# EAGLE design BpodFSM_r2_0 (EAGLE 7.7.0)
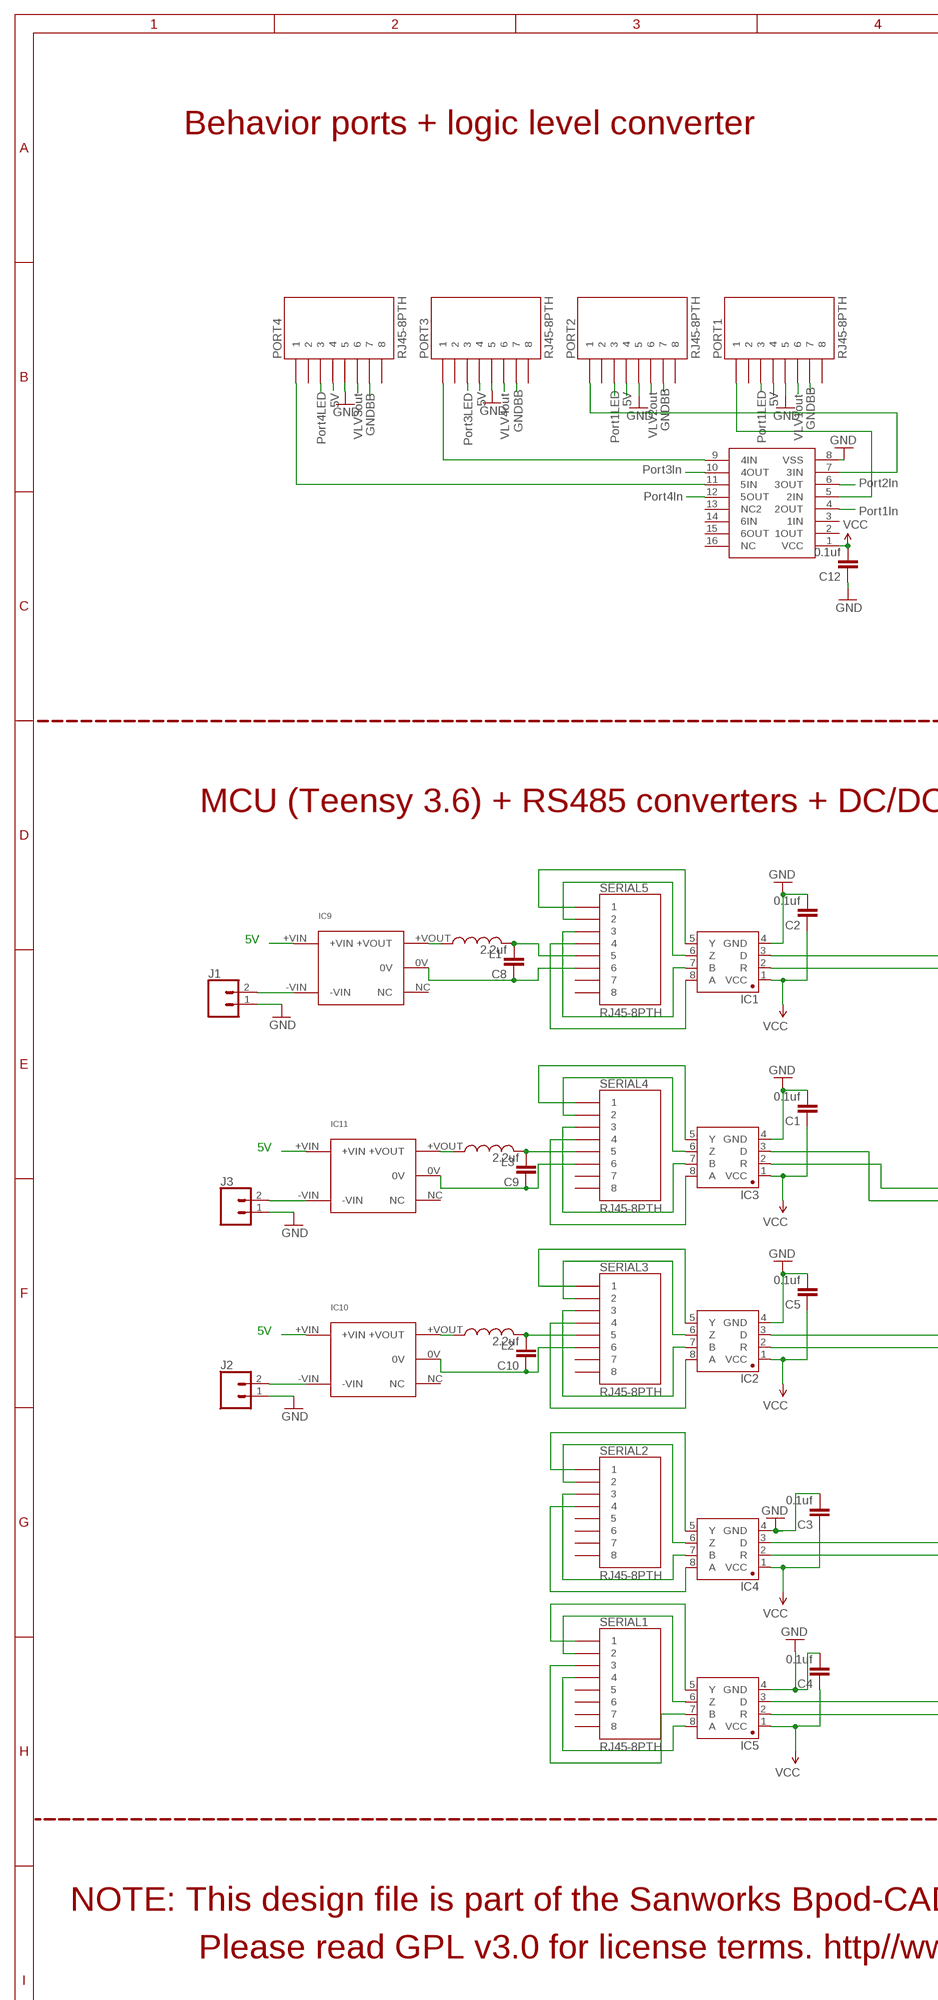
[diagram p0: schematic, sheet 1, part 1 of 2]
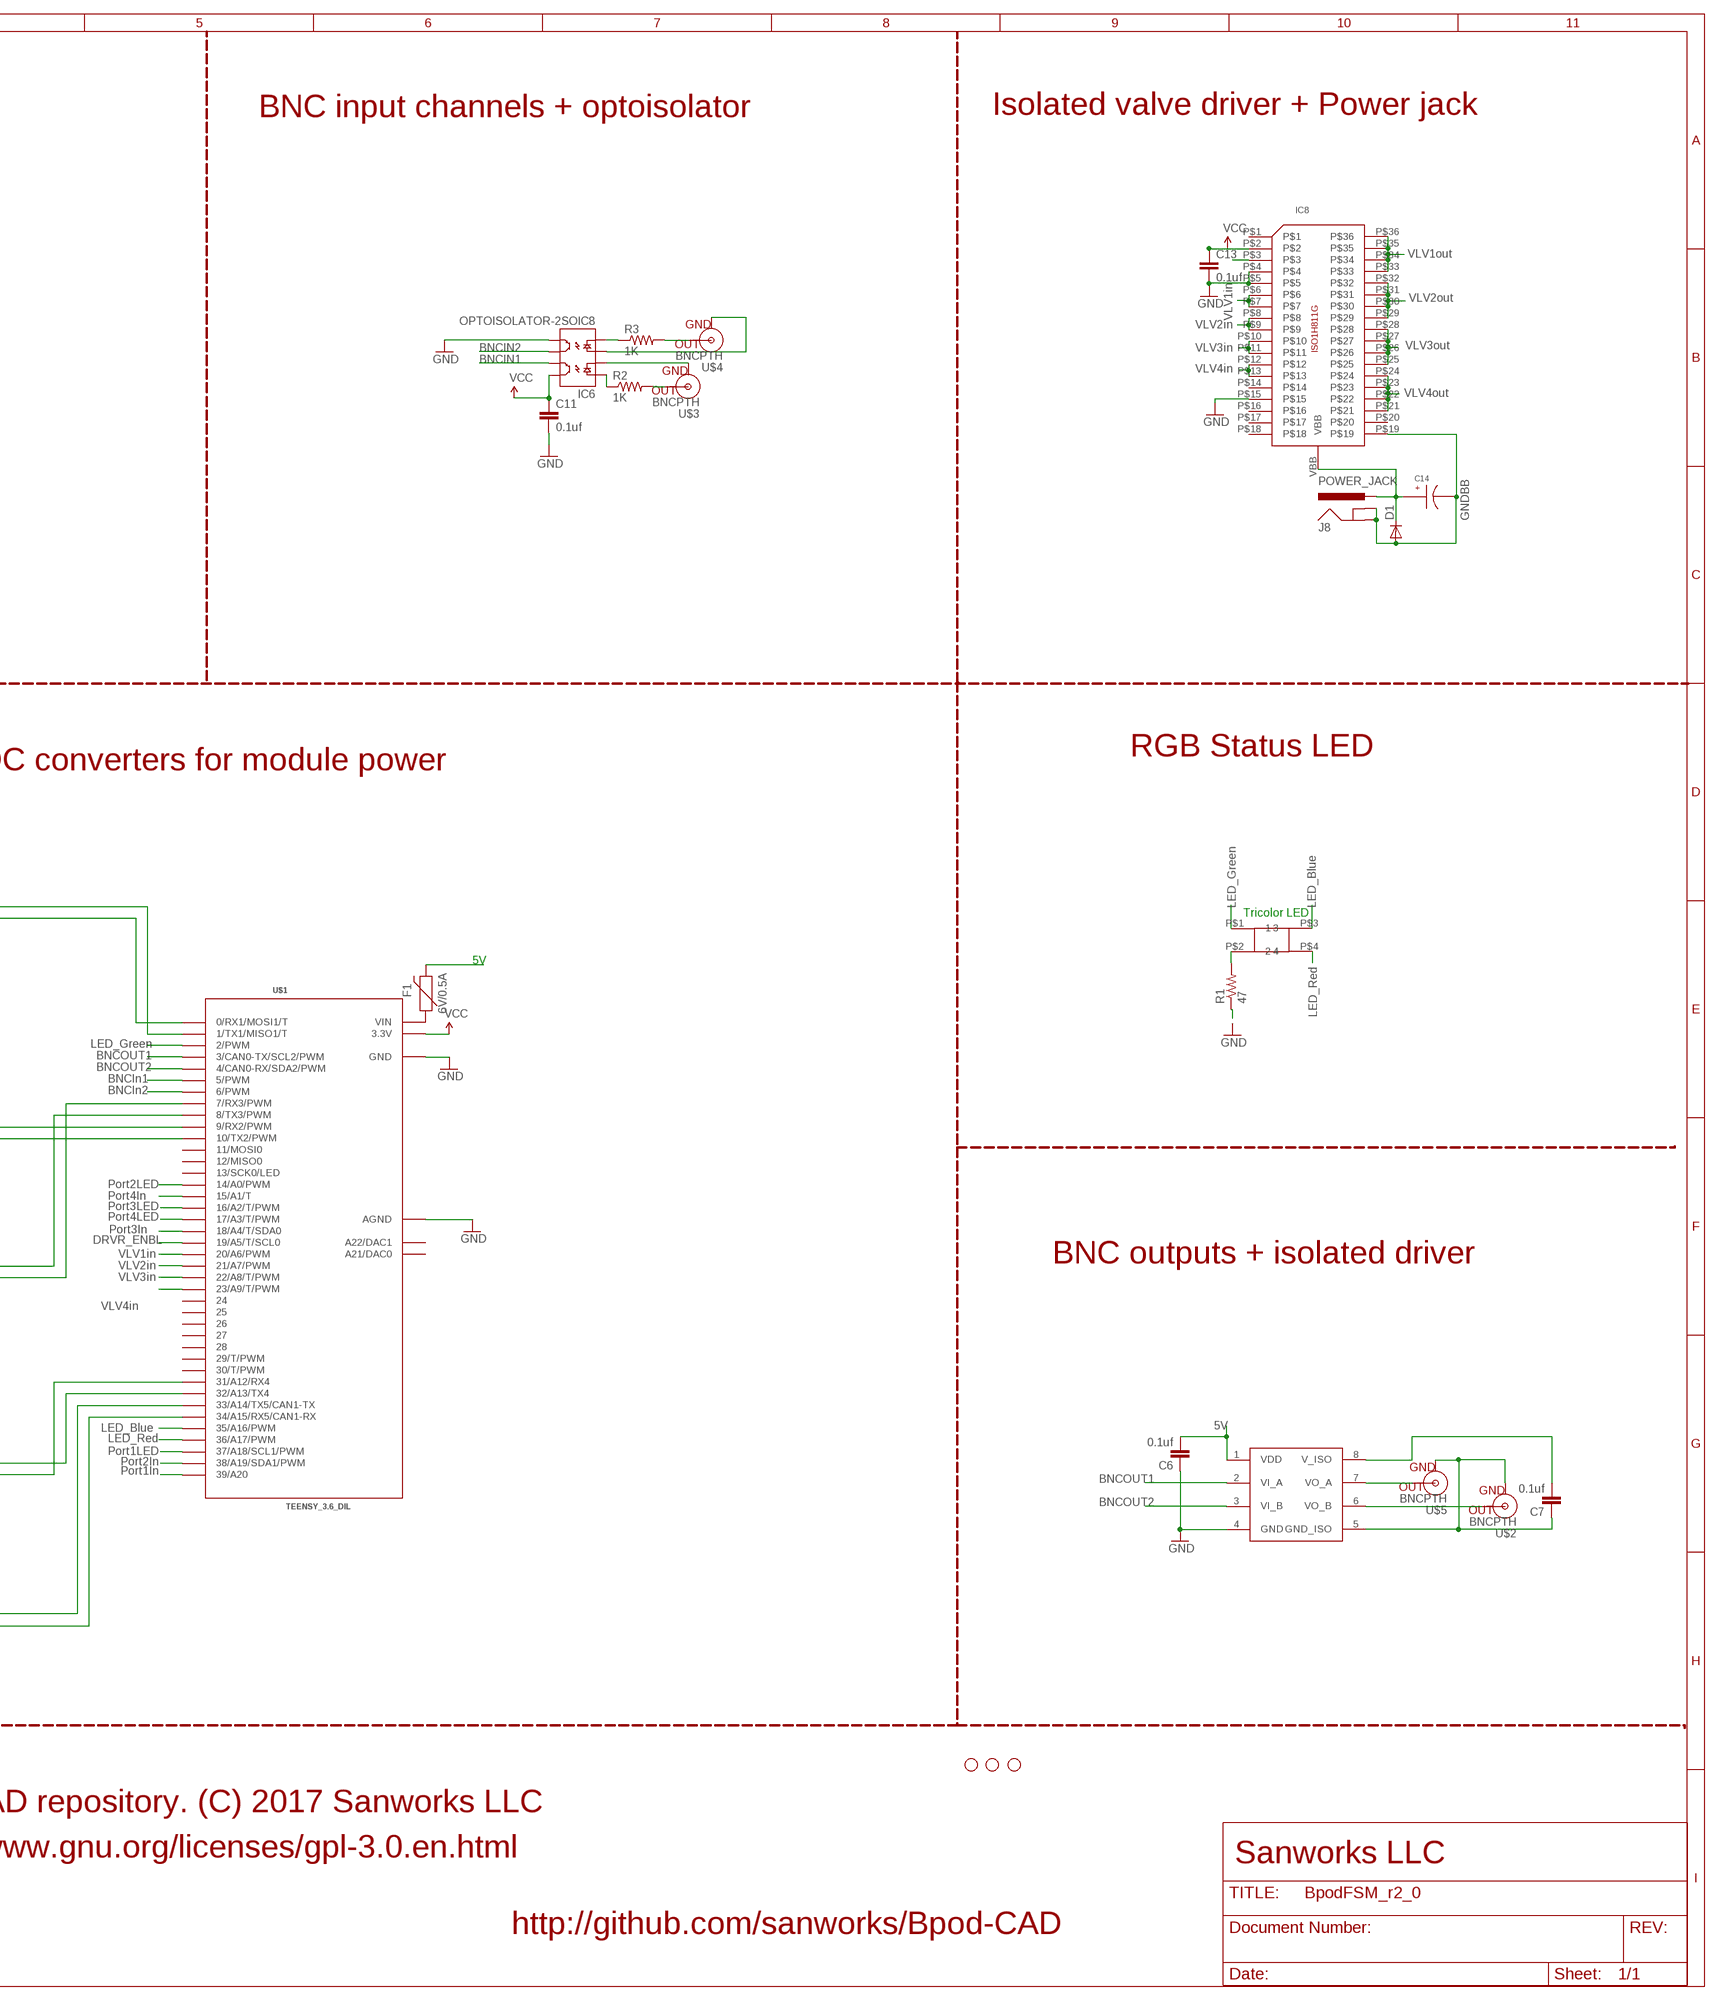
[diagram p1: schematic, sheet 1, part 2 of 2]

## Parts
C1  0.1uf  CAP1206  [1206]
C2  0.1uf  CAP1206  [1206]
C3  0.1uf  CAP1206  [1206]
C4  0.1uf  CAP1206  [1206]
C5  0.1uf  CAP1206  [1206]
C6  0.1uf  CAP1206  [1206]
C7  0.1uf  CAP1206  [1206]
C8  2.2uf  CAP1206  [1206]
C9  2.2uf  CAP1206  [1206]
C10  2.2uf  CAP1206  [1206]
C11  0.1uf  CAP1206  [1206]
C12  0.1uf  CAP1206  [1206]
C13  0.1uf  CAP1206  [1206]
C14  EEE-FK1H100UR  [EEE-FK1H100UR]
D1  DIODE-DO214AA  [DO214AA]
F1  6V/0.5A  PPTC_HALF-AMP  [1206]
IC1  SN65HVD31DR  [SO08]
IC2  SN65HVD31DR  [SO08]
IC3  SN65HVD31DR  [SO08]
IC4  SN65HVD31DR  [SO08]
IC5  SN65HVD31DR  [SO08]
IC6  OPTOISOLATOR-2SOIC8  [SO08-2]
IC7  ADUM5240  [SO08]
IC8  ISO1H811G  [ISO1H811G]
IC9  MTU1D0505MC  [MTU1D0505MC]
IC10  MTU1D0505MC  [MTU1D0505MC]
IC11  MTU1D0505MC  [MTU1D0505MC]
IC12  CD4050  [SO16]
J1  CONN_02  [1X02]
J2  CONN_02  [1X02]
J3  CONN_02  [1X02]
J8  POWER_JACK  [POWER_JACK_PTH]
JP3  STAND-OFF  [STAND-OFF]
JP4  STAND-OFF  [STAND-OFF]
JP5  STAND-OFF  [STAND-OFF]
L1  L-USL3225M  [L3225M]
L2  L-USL3225M  [L3225M]
L3  L-USL3225M  [L3225M]
PORT1  RJ45-8PTH  [RJ45-8]
PORT2  RJ45-8PTH  [RJ45-8]
PORT3  RJ45-8PTH  [RJ45-8]
PORT4  RJ45-8PTH  [RJ45-8]
R1  47  RESISTOR1206  [1206]
R2  1K  RESISTOR1206  [1206]
R3  1K  RESISTOR1206  [1206]
SERIAL1  RJ45-8PTH  [RJ45-8]
SERIAL2  RJ45-8PTH  [RJ45-8]
SERIAL3  RJ45-8PTH  [RJ45-8]
SERIAL4  RJ45-8PTH  [RJ45-8]
SERIAL5  RJ45-8PTH  [RJ45-8]
U$1  TEENSY_3.6_DIL  [TEENSY_3.6_DIL]
U$2  BNCPTH  [BNC]
U$3  BNCPTH  [BNC]
U$4  BNCPTH  [BNC]
U$5  BNCPTH  [BNC]
U$8  SQUARE_TRICOLOR_LED  [SQUARE_TRICOLOR_LED]

## Nets
5V: C6.2 F1.2 IC7.1(VDD) IC9.+VIN IC10.+VIN IC11.+VIN PORT1.4 PORT2.4 PORT3.4 PORT4.4
BNCIN1: IC6.7(EM1) U$1.6(6/PWM)
BNCIN2: IC6.6(CL2) U$1.5(5/PWM)
BNCOUT1: IC7.3(VI_B) U$1.4(4/CAN0-RX/SDA2/PWM)
BNCOUT2: IC7.2(VI_A) U$1.3(3/CAN0-TX/SCL2/PWM)
DRVR_ENBL: IC8.P$3 U$1.19/A5(19/A5/T/SCL0)
GND: C1.2 C2.2 C3.2 C4.2 C5.2 C6.1 C11.2 C12.1 C13.2 IC1.4(GND) IC2.4(GND) IC3.4(GND) IC4.4(GND) IC5.4(GND) IC6.5(EM2) IC7.4(GND) IC8.P$4 IC8.P$5 IC8.P$15 IC12.8(VSS) J1.1 J2.1 J3.1 PORT1.5 PORT2.5 PORT3.5 PORT4.5 R1.1 U$1.AGND U$1.GND U$1.GND1(GND)
GNDBB: C14.CATHODE D1.A IC8.P$19 J8.GND J8.GNDBREAK PORT1.7 PORT2.7 PORT3.7 PORT4.7
ISOGND: C7.1 IC7.5(GND_ISO) U$2.GND U$5.GND
LED_BLUE: U$1.35/A16(35/A16/PWM) U$8.P$3
LED_GREEN: U$1.2(2/PWM) U$8.P$1
LED_RED: U$1.36/A17(36/A17/PWM) U$8.P$4
N$1: IC3.8(A) SERIAL4.4
N$2: IC3.7(B) SERIAL4.3
N$3: IC3.6(Z) SERIAL4.2
N$4: IC3.5(Y) SERIAL4.1
N$5: IC3.2(R) U$1.9(9/RX2/PWM)
N$6: IC3.3(D) U$1.10(10/TX2/PWM)
N$7: IC1.8(A) SERIAL5.4
N$8: IC1.7(B) SERIAL5.3
N$9: IC1.6(Z) SERIAL5.2
N$10: IC1.5(Y) SERIAL5.1
N$11: IC1.2(R) U$1.0(0/RX1/MOSI1/T)
N$12: IC1.3(D) U$1.1(1/TX1/MISO1/T)
N$13: IC6.3(A2) U$4.GND
N$14: R3.2 U$4.S(OUT)
N$15: R2.2 U$3.S(OUT)
N$16: IC6.2(C1) U$3.GND
N$17: IC2.8(A) SERIAL3.4
N$18: IC2.7(B) SERIAL3.3
N$19: IC2.6(Z) SERIAL3.2
N$20: IC12.7(3IN) PORT2.1
N$21: IC2.5(Y) SERIAL3.1
N$22: IC2.2(R) U$1.7(7/RX3/PWM)
N$23: C8.2 L1.2 SERIAL5.5
N$24: IC12.9(4IN) PORT3.1
N$25: R1.2 U$8.P$2
N$26: C8.1 IC9.0V SERIAL5.6
N$27: IC7.7(VO_A) U$5.S(OUT)
N$28: IC2.3(D) U$1.8(8/TX3/PWM)
N$29: F1.1 U$1.VIN
N$30: IC7.6(VO_B) U$2.S(OUT)
N$31: IC12.11(5IN) PORT4.1
N$32: IC5.8(A) SERIAL1.4
N$33: IC5.7(B) SERIAL1.3
N$34: IC5.6(Z) SERIAL1.2
N$35: IC5.5(Y) SERIAL1.1
N$36: IC4.8(A) SERIAL2.4
N$37: IC4.7(B) SERIAL2.3
N$38: IC4.6(Z) SERIAL2.2
N$39: IC9.+VOUT L1.1
N$40: IC4.5(Y) SERIAL2.1
N$41: IC9.-VIN J1.2
N$42: IC5.2(R) U$1.34/A15(34/A15/RX5/CAN1-RX)
N$43: C10.1 IC10.0V SERIAL3.6
N$44: C10.2 L2.2 SERIAL3.5
N$45: IC10.+VOUT L2.1
N$46: IC10.-VIN J2.2
N$47: C9.1 IC11.0V SERIAL4.6
N$48: IC5.3(D) U$1.33/A14(33/A14/TX5/CAN1-TX)
N$49: C9.2 L3.2 SERIAL4.5
N$50: IC11.+VOUT L3.1
N$51: IC11.-VIN J3.2
N$52: IC4.2(R) U$1.31/A12(31/A12/RX4)
N$53: IC4.3(D) U$1.32/A13(32/A13/TX4)
N$54: IC6.1(A1) R2.1
N$55: IC6.4(C2) R3.1
N$56: IC12.5(2IN) PORT1.1
N$64: C7.2 IC7.8(V_ISO)
PORT1IN: IC12.4(2OUT) U$1.39/A20
PORT1LED: PORT1.3 U$1.37/A18(37/A18/SCL1/PWM)
PORT2IN: IC12.6(3OUT) U$1.38/A19(38/A19/SDA1/PWM)
PORT2LED: PORT2.3 U$1.14/A0(14/A0/PWM)
PORT3IN: IC12.10(4OUT) U$1.18/A4(18/A4/T/SDA0)
PORT3LED: PORT3.3 U$1.16/A2(16/A2/T/PWM)
PORT4IN: IC12.12(5OUT) U$1.15/A1(15/A1/T)
PORT4LED: PORT4.3 U$1.17/A3(17/A3/T/PWM)
VBB: C14.ANODE D1.C IC8.VBB J8.PWR
VCC: C1.1 C2.1 C3.1 C4.1 C5.1 C11.1 C12.2 C13.1 IC1.1(VCC) IC2.1(VCC) IC3.1(VCC) IC4.1(VCC) IC5.1(VCC) IC6.8(CL1) IC8.P$2 IC12.1(VCC) U$1.3.3V U$1.3.3V3(3.3V)
VLV1IN: IC8.P$6 IC8.P$7 U$1.23/A9(23/A9/T/PWM)
VLV1OUT: IC8.P$33 IC8.P$34 IC8.P$35 IC8.P$36 PORT1.6
VLV2IN: IC8.P$8 IC8.P$9 U$1.22/A8(22/A8/T/PWM)
VLV2OUT: IC8.P$29 IC8.P$30 IC8.P$31 IC8.P$32 PORT2.6
VLV3IN: IC8.P$12 IC8.P$13 U$1.20/A6(20/A6/PWM)
VLV3OUT: IC8.P$21 IC8.P$22 IC8.P$23 IC8.P$24 PORT3.6
VLV4IN: IC8.P$10 IC8.P$11 U$1.21/A7(21/A7/PWM)
VLV4OUT: IC8.P$25 IC8.P$26 IC8.P$27 IC8.P$28 PORT4.6
Unconnected: IC8.P$1 IC8.P$14 IC8.P$16 IC8.P$17 IC8.P$18 IC8.P$20 IC9.NC IC10.NC IC11.NC IC12.2(1OUT) IC12.3(1IN) IC12.13(NC2) IC12.14(6IN) IC12.15(6OUT) IC12.16(NC) PORT1.2 PORT1.8 PORT2.2 PORT2.8 PORT3.2 PORT3.8 PORT4.2 PORT4.8 SERIAL1.5 SERIAL1.6 SERIAL1.7 SERIAL1.8 SERIAL2.5 SERIAL2.6 SERIAL2.7 SERIAL2.8 SERIAL3.7 SERIAL3.8 SERIAL4.7 SERIAL4.8 SERIAL5.7 SERIAL5.8 U$1.11(11/MOSI0) U$1.12(12/MISO0) U$1.13(13/SCK0/LED) U$1.24 U$1.25 U$1.26 U$1.27 U$1.28 U$1.29(29/T/PWM) U$1.30(30/T/PWM) U$1.A21(A21/DAC0) U$1.A22(A22/DAC1)

## Notes on the sheet
- BNC input channels + optoisolator | Isolated valve driver + Power jack
- Behavior ports + logic level converter
- VLV1out
- VLV2out
- VLV1in
- VLV2in
- BNCIN2 | VLV3in | VLV3out
- BNCIN1
- VLV4in
- 5V | 5V | 5V | 5V
- VLV4out
- GNDBB | GNDBB | GNDBB
- GNDBB | VLV2out
- VLV3out | VLV4out | VLV1out
- Port4LED | Port3LED | Port1LED | Port1LED
- Port3In
- Port2In
- Port4In
- GNDBB
- Port1In
- RGB Status LED
- MCU (Teensy 3.6) + RS485 converters + DC/DC converters for module power
- LED_Green
- LED_Blue
- 5V
- Tricolor LED
- 5V | LED_Red
- LED_Green
- BNCOUT1
- BNCOUT2
- BNCIn1
- 5V | BNCIn2
- Port2LED
- Port4In
- Port3LED
- Port4LED
- Port3In
- DRVR_ENBL
- VLV1in
- 5V | BNC outputs + isolated driver
- VLV2in
- VLV3in
- VLV4in
- LED_Blue | 5V
- LED_Red
- Port1LED
- Port2In
- Port1In
- BNCOUT1
- BNCOUT2
- NOTE: This design file is part of the Sanworks Bpod-CAD repository. (C) 2017 Sanworks LLC
- Please read GPL v3.0 for license terms. http//www.gnu.org/licenses/gpl-3.0.en.html | Sanworks LLC
- http://github.com/sanworks/Bpod-CAD

## Library data of the parts
C1-C13 = SparkFun-Capacitors:CAP: Capacitor Standard 0603 ceramic capacitor, and 0.1" leaded capacitor.
C14 = JoshParts10:EEE-FK1H100UR
D1 = diode:DIODE-: DIODE
F1 = SparkFun-Fuses:PPTC: Resettable Fuse PPTC Resettable Fuse. Really a sort of resistor with a polymeric positive temperature coefficient whose resistance increases dramatically with an increase in temperature. When heated by the power passing through the resistance rises causing the current to be limited, protecting the circuit. This is achieved by the transition of the polymer from a crystalline to an amorphous state where the conductive carbon separates breaking the conductive pathways found in the cool crystalline structure. When a PPTC cools back down it resumes conducting letting the circuit turn back on. SparkFun Products: SparkFun RedBoard - Programmed with Arduino <https://www.sparkfun.com/products/12757> Pro Micro - 5V/16MHz <https://www.sparkfun.com/products/12640> Arduino Pro 328 - 5V/16MHz <https://www.sparkfun.com/products/10915> MP3 Trigger <https://www.sparkfun.com/products/13720>; PROD_ID: RES-08585
IC1-IC5 = Joshparts4:SN65HVD31DR: A placeholder for generic narrow & wide SOIC8 foorptints - used on the DIP adapter board.
IC6 = SparkFun-DiscreteSemi:OPTOISOLATOR-2: Description: Dual gate opto isolator. Vishay part : ILD213T; PROD_ID: IC-09076
IC7 = SparkFun-DigitalIC:ADUM5240
IC8 = JoshParts10:ISO1H811G
IC9-IC11 = JoshParts10:MTU1D0505MC
IC12 = SparkFun-DigitalIC:CD4050
J1-J3 = SparkFun-Connectors:CONN_02: Multi connection point. Often used as Generic Header-pin footprint for 0.1 inch spaced/style header connections On any of the 0.1 inch spaced packages, you can populate with these: Break Away Headers - Straight <https://www.sparkfun.com/products/116> (PRT-00116) Break Away Male Headers - Right Angle <https://www.sparkfun.com/products/553> (PRT-00553) Female Headers <https://www.sparkfun.com/products/115> (PRT-00115) Break Away Headers - Machine Pin <https://www.sparkfun.com/products/117> (PRT-00117) Break Away Female Headers - Swiss Machine Pin <https://www.sparkfun.com/products/743> (PRT-00743) For SCREWTERMINALS and SPRING TERMINALS visit here: Screw Terimnals on SparkFun.com <https://www.sparkfun.com/search/results?term=Screw+Terminals> (5mm/3.5mm/2.54mm spacing) This device is also useful as a general connection point to wire up your design to another part of your project. Our various solder wires solder well into these plated through hole pads. Hook-Up Wire - Assortment (Stranded, 22 AWG) <https://www.sparkfun.com/products/11375> (PRT-11375) Hook-Up Wire - Assortment (Solid Core, 22 AWG) <https://www.sparkfun.com/products/11367> (PRT-11367) View the entire wire category on our website here <https://www.sparkfun.com/categories/141> Special notes: Molex polarized connector foot print use with: PRT-08233 with associated crimp pins and housings. 2.54_SCREWTERM for use with PRT-10571. 3.5mm Screw Terminal footprints for PRT-08084 5mm Screw Terminal footprints for use with PRT-08432
J8 = SparkFun-Connectors:POWER_JACK: Power Jack Connector This is the standard 5.5mm barrel jack for power. The PTH is the most common, proven, reliable, footprint. The Slot footprint only works if the mill layer is transmitted to the PCB fab house so be warned. Here are the connectors we sell at SparkFun: DC Barrel Power Jack/Connector <https://www.sparkfun.com/products/119> (PRT-00119) DC Barrel Power Jack/Connector (SMD) <https://www.sparkfun.com/products/12748> (PRT-12748) DC Barrel Jack Adapter - Breadboard Compatible <https://www.sparkfun.com/products/10811> (PRT-10811) It is used on this SparkFun product (and many, many others): SparkFun RedBoard - Programmed with Arduino <https://www.sparkfun.com/products/12757> (DEV-12757) Also, if you need a mating power supply or connector, please check these out: Wall Adapter Power Supply - 9VDC 650mA <https://www.sparkfun.com/products/298> (TOL-00298) DC Barrel Jack Adapter - Male <https://www.sparkfun.com/products/10287> (PRT-10287); PROD_ID: CONN-08197
JP3-JP5 = SparkFun:STAND-OFF: Stand Off This is the mechanical footprint for a #4 phillips button head screw. Use the keepout ring to avoid running the screw head into surrounding components. SKU : PRT-00447
L1-L3 = rcl:L-US: INDUCTOR, American symbol
PORT1-PORT4 SERIAL1-SERIAL5 = SparkFun:RJ45-8: RJ45 Jack Simple RJ45, 8-pin connection - connector for common Cat5, Cat5e, and Cat6 Ethernet cables. Footprint not yet proven in production. Connector sku is PRT-00643; Breakout PCB sku is BOB-00716.
R1 = SparkFun-Passives:RESISTOR: Resistor Basic schematic elements and footprints for 0603, 1206, and PTH resistors.
R2 R3 = SparkFun-Resistors:RESISTOR: Resistor Basic schematic elements and footprints for 0603, 1206, and PTH resistors.
U$1 = Teensy_3_and_LC_Series_Boards_v1.4:TEENSY_3.6_DIL: Teensy 3.6 DIL Package
U$2-U$5 = SparkFun:BNC: BNC Connector, Mouser Part# 5227161
U$8 = JoshParts:SQUARE_TRICOLOR_LED

## Net classes
0 default: width 0.254 mm, clearance 0.254 mm

## Board
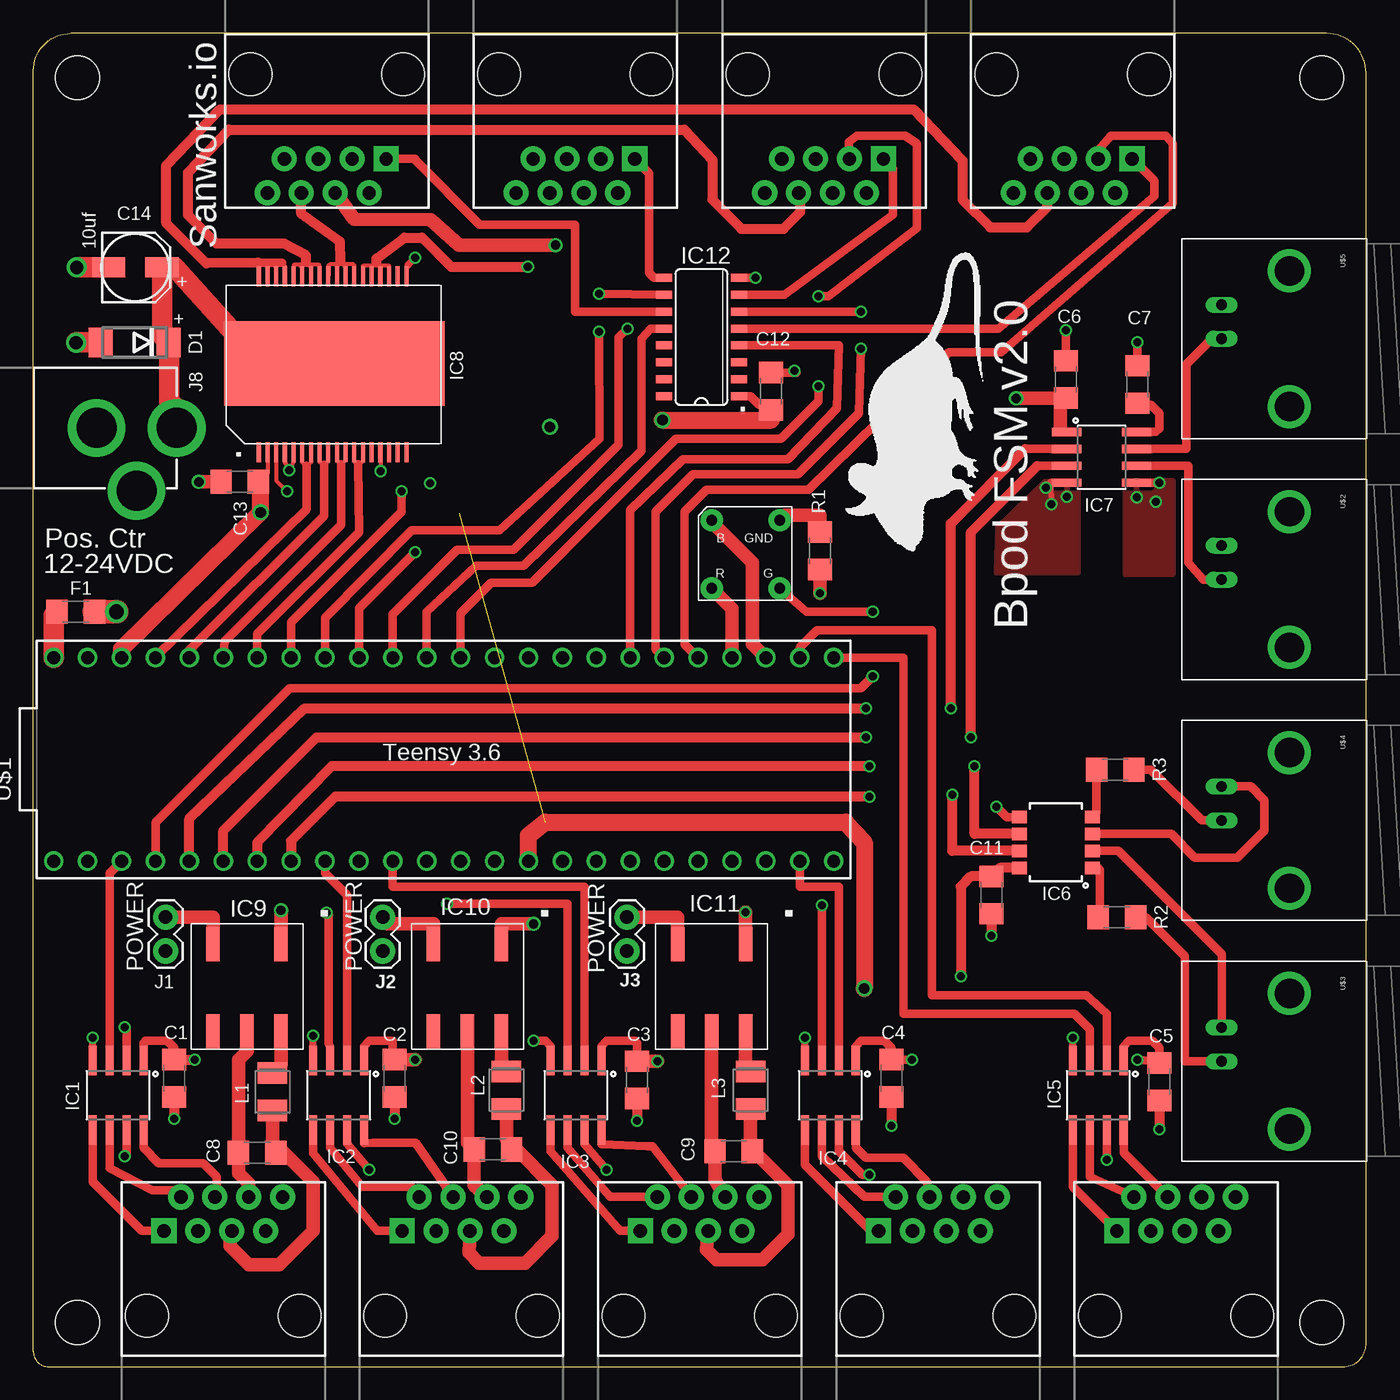
[diagram p2: board, top side]
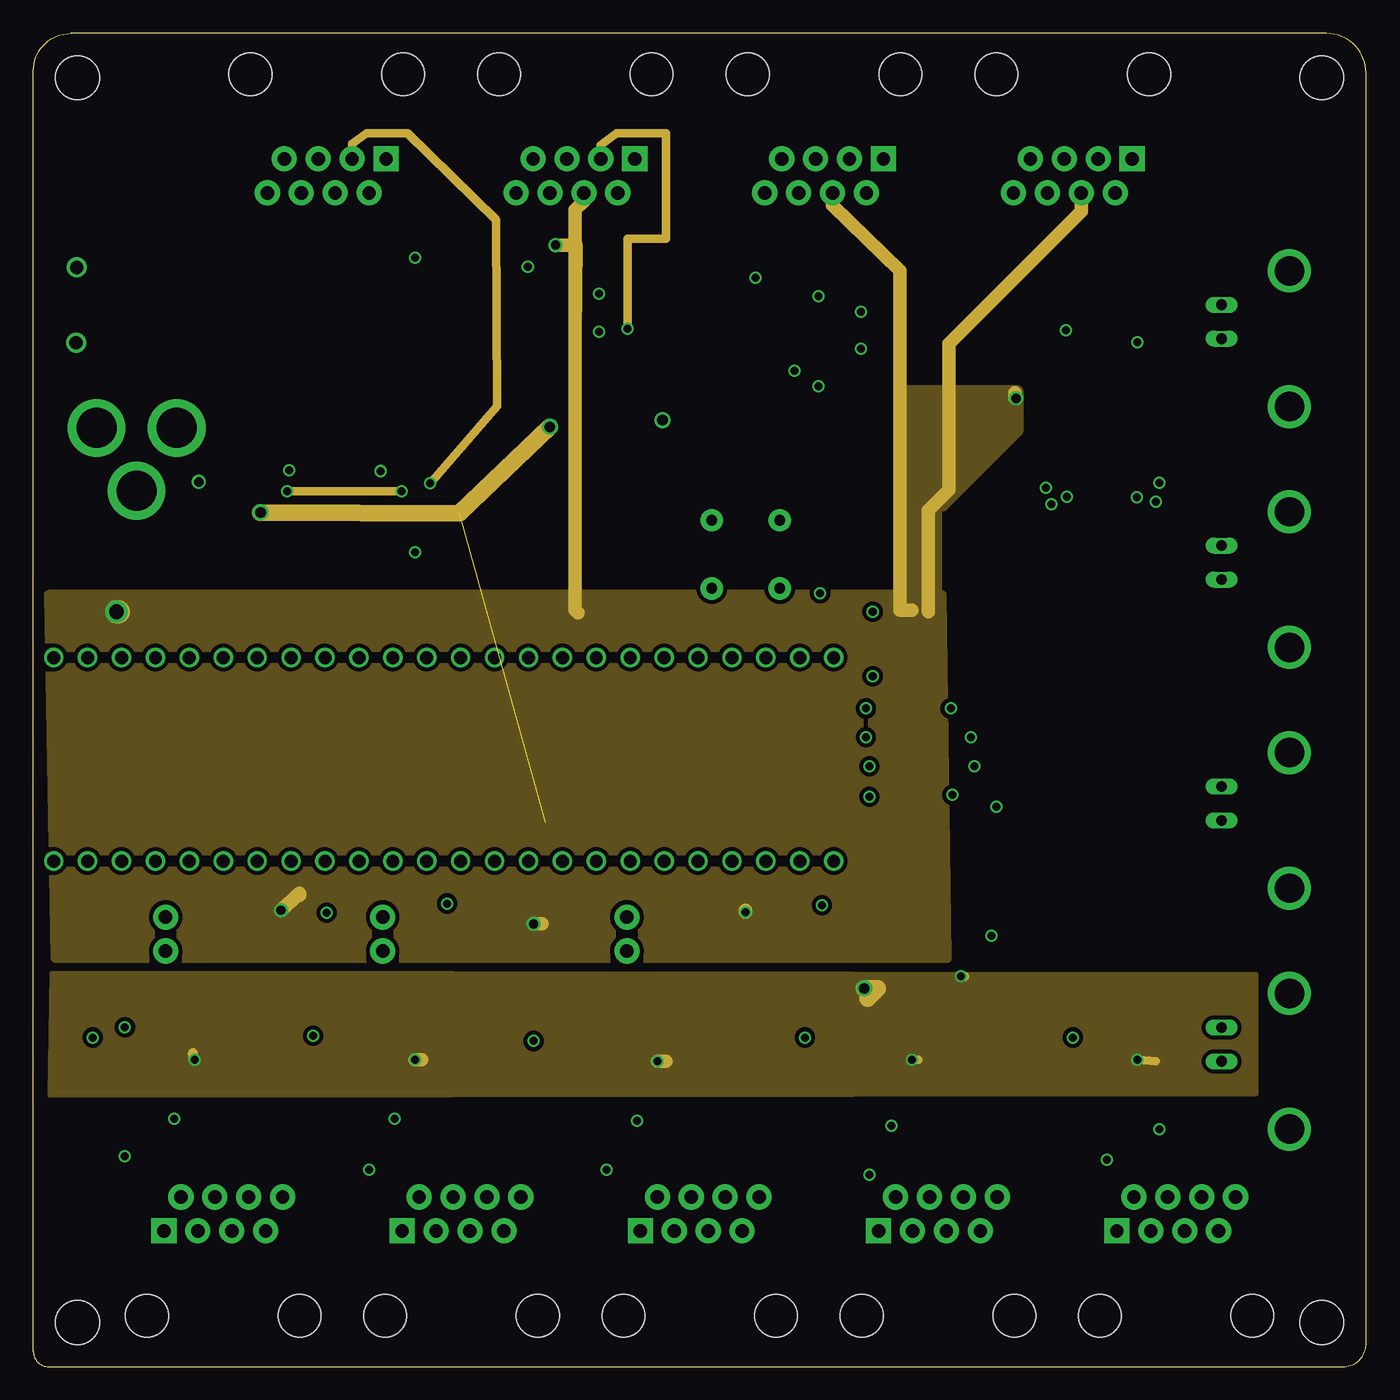
[diagram p3: board, inner layer Route2]
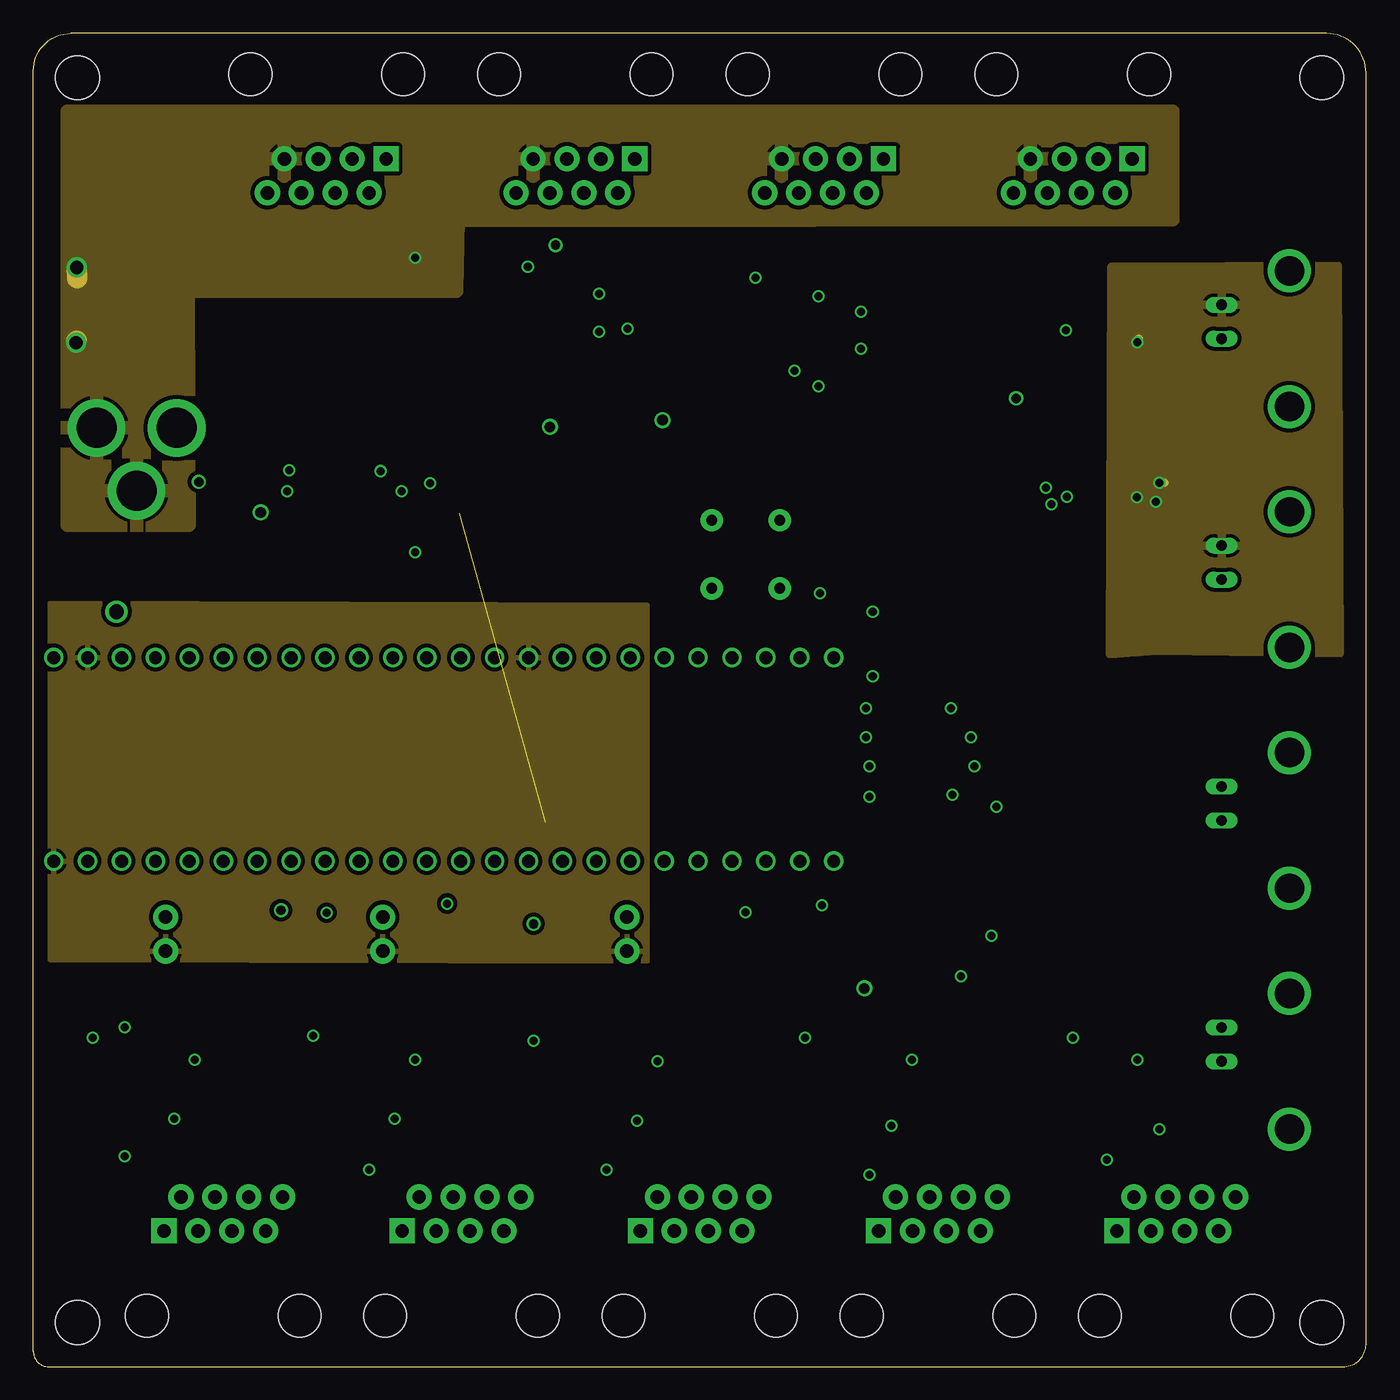
[diagram p4: board, inner layer Route15]
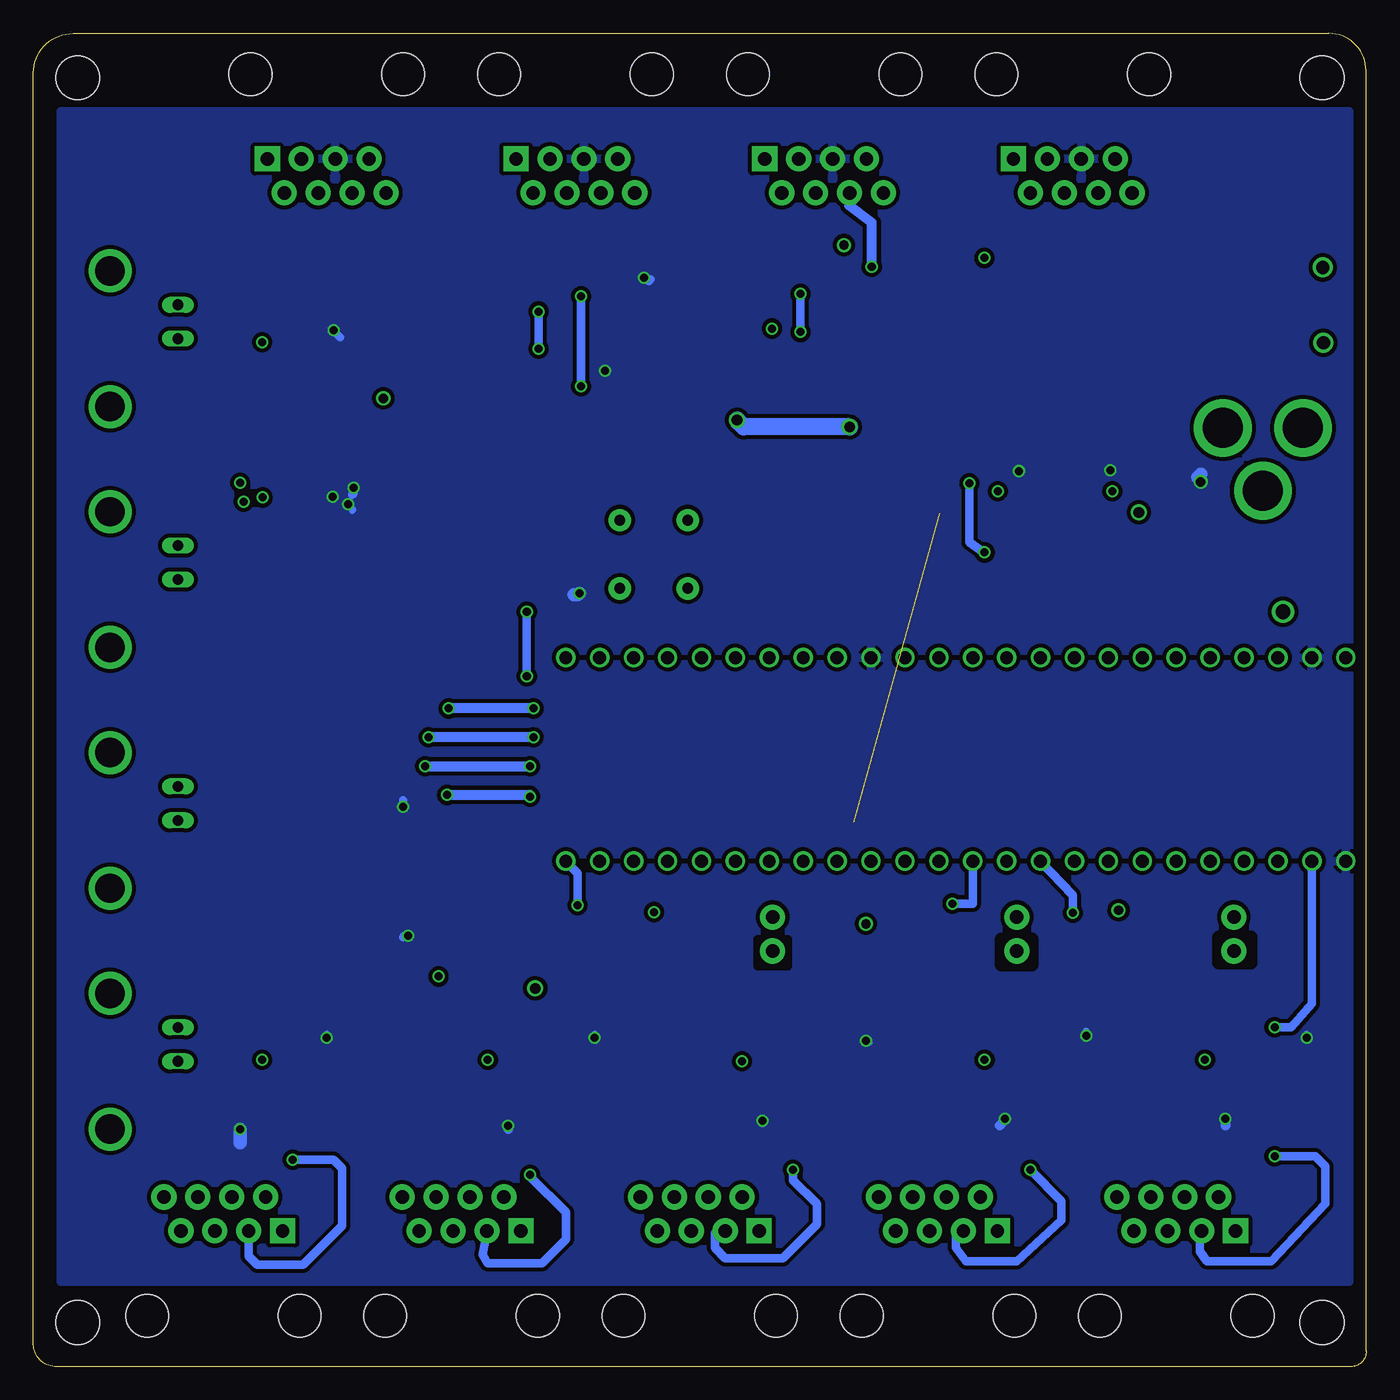
[diagram p5: board, bottom side, seen from below]

Size 99.82 x 99.82 mm. Coordinates in mm from the lower left corner, seen from the top.
Outline: 0,1.14 0,97.04 arc-90 2.79,99.82 96.86,99.82 arc-90 99.82,96.86 99.82,1.79 arc-90 98.21,0 1.14,0 arc-90 0,1.14
Copper layers (1*2*15*16): Top 0.035mm / dielectric 0.2mm / Route2 0.0175mm / dielectric 0.3mm / Route15 0.0175mm / dielectric 0.2mm / Bottom 0.035mm
Design rules "SeeedStudio_4layer_DRU_no_angle_20140221 *": minimum track width 8mil, minimum drill 12mil, track to track 12mil, track to pad 12mil, pad to pad 12mil, via to via 12mil, smd to smd 0mil, copper to edge 10mil, drill to drill 8mil, minimum pad ring 6mil, minimum via ring 4mil, stop-mask expansion 4mil, vias tented up to drill 25mil, thermal gap 10mil
bRestrict: area 8.6,30.2 to 11,32.1; area 25,30.1 to 27.3,32; area 43.3,30 to 45.6,32

### Footprints (pad centres in the part's own frame; a part is rotated, then mirrored left to right if it is on the bottom)
1206 = smd 1.6 x 1.8: 1 -1.4,0; 2 1.4,0
EEE-FK1H100UR = smd 1.5 x 2.5: ANODE 0,4; CATHODE 0,0
DO214AA = smd 1.8 x 2.2: A 2.55,0; C -2.55,0
SO08 = smd 0.61 x 2.21: 1 -1.905,-2.616; 2 -0.635,-2.616; 3 0.635,-2.616; 4 1.905,-2.616; 5 1.905,2.616; 6 0.635,2.616; 7 -0.635,2.616; 8 -1.905,2.616
SO08-2 = smd 0.914 x 1.143: 1 -1.905,-2.731; 2 -0.635,-2.731; 3 0.635,-2.731; 4 1.905,-2.731; 5 1.905,2.731; 6 0.635,2.731; 7 -0.635,2.731; 8 -1.905,2.731
ISO1H811G = smd 1.5 x 0.305: P$1 0,11.05; P$2 0,10.4; P$3 0,9.75; P$4 0,9.1; P$5 0,8.45; P$6 0,7.8; P$7 0,7.15; P$8 0,6.5; P$9 0,5.85; P$10 0,5.2; P$11 0,4.55; P$12 0,3.9; P$13 0,3.25; P$14 0,2.6; P$15 0,1.95; P$16 0,1.3; P$17 0,0.65; P$18 0,0; P$19 13.2,0; P$20 13.2,0.65; P$21 13.2,1.3; P$22 13.2,1.95; P$23 13.2,2.6; P$24 13.2,3.25; P$25 13.2,3.9; P$26 13.2,4.55; P$27 13.2,5.2; P$28 13.2,5.85; P$29 13.2,6.5; P$30 13.2,7.15; P$31 13.2,7.8; P$32 13.2,8.45; P$33 13.2,9.1; P$34 13.2,9.75; P$35 13.2,10.4; P$36 13.2,11.05 | smd 6.3 x 16.51: VBB 6.65,5.4
MTU1D0505MC = smd 2.54 x 1.016: 0V 6.502,0; +VIN 0,2.54; +VOUT 6.502,2.54; -VIN 0,-2.54; NC 6.502,-2.54
SO16 = smd 0.6 x 1.2: 1 -4.445,-2.8; 2 -3.175,-2.8; 3 -1.905,-2.8; 4 -0.635,-2.8; 5 0.635,-2.8; 6 1.905,-2.8; 7 3.175,-2.8; 8 4.445,-2.8; 9 4.445,2.8; 10 3.175,2.8; 11 1.905,2.8; 12 0.635,2.8; 13 -0.635,2.8; 14 -1.905,2.8; 15 -3.175,2.8; 16 -4.445,2.8
1X02 = drill 1.016 pad 1.88: 1 0,0; 2 2.54,0
POWER_JACK_PTH = drill 2.997 pad 4.318: GND 0,7.7; GNDBREAK 4.7,10.7; PWR 0,13.7
STAND-OFF = hole 3.302: 0,0
L3225M = smd 1.6 x 2.2: 1 -1.4,0; 2 1.4,0
RJ45-8 = drill 1 pad 1.88 square: 1 -4.445,6.35 | drill 1 pad 1.88: 2 -3.175,8.89; 3 -1.905,6.35; 4 -0.635,8.89; 5 0.635,6.35; 6 1.905,8.89; 7 3.175,6.35; 8 4.445,8.89 | hole 3.2: -5.715,0; 5.715,0
TEENSY_3.6_DIL = drill 0.965: 0 -7.62,25.4; 1 -7.62,22.86; 2 -7.62,20.32; 3 -7.62,17.78; 3.3V 7.62,22.86; 3.3V3 -7.62,-7.62; 4 -7.62,15.24; 5 -7.62,12.7; 6 -7.62,10.16; 7 -7.62,7.62; 8 -7.62,5.08; 9 -7.62,2.54; 10 -7.62,0; 11 -7.62,-2.54; 12 -7.62,-5.08; 13 7.62,-5.08; 14/A0 7.62,-2.54; 15/A1 7.62,0; 16/A2 7.62,2.54; 17/A3 7.62,5.08; 18/A4 7.62,7.62; 19/A5 7.62,10.16; 20/A6 7.62,12.7; 21/A7 7.62,15.24; 22/A8 7.62,17.78; 23/A9 7.62,20.32; 24 -7.62,-10.16; 25 -7.62,-12.7; 26 -7.62,-15.24; 27 -7.62,-17.78; 28 -7.62,-20.32; 29 -7.62,-22.86; 30 -7.62,-25.4; 31/A12 -7.62,-27.94; 32/A13 -7.62,-30.48; 33/A14 7.62,-30.48; 34/A15 7.62,-27.94; 35/A16 7.62,-25.4; 36/A17 7.62,-22.86; 37/A18 7.62,-20.32; 38/A19 7.62,-17.78; 39/A20 7.62,-15.24; A21 7.62,-12.7; A22 7.62,-10.16; AGND 7.62,25.4; GND -7.62,27.94; GND1 7.62,-7.62; VIN 7.62,27.94
BNC = drill 2.2: 3 -5.08,5.08; 4 5.08,5.08 | drill 0.8 long: GND -2.54,0; S 0,0
SQUARE_TRICOLOR_LED = drill 0.8 pad 1.676: P$1 -5.1,5.1; P$2 -5.1,0; P$3 0,0; P$4 0,5.1

### Placement (x,y rotation side)
C1  10.54,21.59 270 top
C2  27.05,21.59 270 top
C3  45.21,21.46 270 top
C4  64.26,21.59 270 top
C5  84.33,21.34 270 top
C6  77.34,73.91 270 top
C7  82.68,73.53 270 top
C8  16.76,16 0 top
C9  52.45,16.13 0 top
C10  34.42,16.26 0 top
C11  71.75,35.31 270 top
C12  55.24,73.03 270 top
C13  15.47,66.27 180 top
C14  5.64,82.3 270 top
D1  7.59,76.68 180 top
F1  3.17,56.52 0 top
IC1  6.35,20.32 180 top
IC2  22.86,20.32 180 top
IC3  40.64,20.32 180 top
IC4  59.69,20.32 180 top
IC5  79.76,20.32 180 top
IC6  76.58,39.24 90 top
IC7  80.01,68.07 270 top
IC8  27.94,68.45 90 top
IC9  16,31.62 270 top
IC10  32.51,31.62 270 top
IC11  50.8,31.62 270 top
IC12  50.04,77.09 90 top
J1  9.91,31.11 90 top
J2  26.16,31.11 90 top
J3  44.45,31.11 90 top
J8  -2.97,70.28 270 top
JP1  STAND-OFF  [STAND-OFF]  3.3,3.3 0 top
JP3  3.3,96.5 0 top
JP4  96.5,96.5 0 top
JP5  96.5,3.3 0 top
L1  17.91,20.57 270 top
L2  35.43,20.7 270 top
L3  53.72,20.7 270 top
PORT1  77.85,96.77 180 top
PORT2  59.22,96.77 180 top
PORT3  40.6,96.77 180 top
PORT4  21.97,96.77 180 top
R1  58.93,61.09 90 top
R2  81.15,33.66 0 top
R3  81.03,44.7 0 top
SERIAL1  85.6,3.81 0 top
SERIAL2  67.75,3.81 0 top
SERIAL3  32.07,3.81 0 top
SERIAL4  49.91,3.81 0 top
SERIAL5  14.22,3.81 0 top
U$1  29.46,45.47 90 top
U$2  89,58.93 270 top
U$3  89,22.86 270 top
U$4  89,40.89 270 top
U$5  89,76.96 270 top
U$8  50.8,63.37 180 top
U$9  [MOUSELOGO]  58.99,59.13 0 top

### Tracks (layer width: path | path; a pad name or v marks a point on that pad's centre or on a via)
5V  (via drill 0.6, 0.7, 1.1)
  Top 0.406: 76.91,70.21 76.89,70 IC7.1
  Top 1: v73.61,72.49 73.61,72.51 C6.2 76.91,72.51 76.91,70.21
  Top 1.016: IC9.+VIN v18.54,34.16 | IC10.+VIN 35.05,33.15 v37.47,33.15 | IC11.+VIN v53.34,34.04 | PORT4.4 24.03,85.9 29.77,85.85 31.9,83.97 v39.12,83.97
  Top 1.778: F1.2 v6.22,56.52
  Route2 1: v73.61,72.49 73.51,72.49 73.51,72.9
  Route2 1.016: v18.54,34.16 19.94,35.43 19.94,35.31 | v37.47,33.15 38.1,33.15 | v53.34,34.04 53.34,34.16 | PORT1.4 78.49,86.49 68.58,76.58 68.58,65.66 67.06,64.14 67.06,56.52 | PORT2.4 59.86,86.95 64.9,82.04 64.9,56.64 65.79,56.64 | PORT3.4 41.23,87.26 40.59,86.61 40.59,77.22 | 40.59,77.22 40.59,56.64 40.79,56.44 | v39.12,83.97 40.64,83.97 40.59,77.22
  Route2 1.778: v6.22,56.52 6.35,56.52
  pour Route2: 1.14,57.78 1.65,30.61 68.43,30.61 68.05,57.78
  pour Route2: 65.02,57.91 67.56,57.91 67.56,64.52 68.07,64.52 73.66,70.1 73.66,73 65.02,73
BNCIN1  (via drill 0.6)
  Top 0.762: IC6.7 68.83,38.61 v68.83,42.8 | v62.61,42.67 22.61,42.67 19.3,39.37 U$1.6
  Bottom 0.762: v68.83,42.8 62.61,42.8 v62.61,42.67
BNCIN2  (via drill 0.6)
  Top 0.762: IC6.6 70.48,39.88 v70.48,44.96 | v62.61,44.96 22.35,44.96 16.76,39.24 U$1.5
  Bottom 0.762: v70.48,44.96 v62.61,44.96
BNCOUT1  (via drill 0.6)
  Top 0.635: 75.18,67.44 IC7.3
  Top 0.762: U$1.4 14.22,40.13 21.21,47.12 v62.36,47.12 | v70.23,47.12 70.23,62.48 75.18,67.44
  Bottom 0.762: v62.36,47.12 v70.23,47.12
BNCOUT2  (via drill 0.6)
  Top 0.635: 74.3,68.71 IC7.2
  Top 0.762: U$1.3 11.68,41.02 20.32,49.28 v62.36,49.28 | v68.71,49.28 68.71,63.12 74.3,68.71
  Bottom 0.762: v62.36,49.28 v68.71,49.28
DRVR_ENBL  (via drill 0.6)
  Top 0.318: IC8.P$3 18.19,66.34 v19,65.53
  Top 0.635: v27.58,65.53 27.58,64.01 19.3,55.73 U$1.19/A5
  Route2 0.635: v19,65.53 v27.58,65.53
GND  (via drill 0.6, 0.7)
  Top 0.318: IC8.P$4 18.84,67.67 v19.15,67.11 19.49,67.7 IC8.P$5 | IC8.P$15 25.99,67.16 v26.01,67.06
  Top 0.406: 76.2,66.17 v76.25,64.57
  Top 0.508: IC2.4 v20.95,24.77 | IC1.4 v4.45,24.64 | IC4.4 v57.78,24.64 | IC5.4 v77.85,24.64
  Top 0.635: IC3.4 38.73,24 38.35,24.38 v37.47,24.38 | IC6.5 72.9,41.15 v72.14,41.91 | IC7.4 76.2,66.17 | C6.1 v77.34,77.6 | IC12.8 v54.1,81.53 | C12.1 57.15,74.42 v57.02,74.55
  Top 0.762: C5.2 v84.33,17.78 | C4.2 v64.26,18.03 | C3.2 v45.21,18.41 | C2.2 v27.05,18.54 | C1.2 v10.54,18.54 | C11.2 v71.75,32.26
  Top 1.016: R1.1 v58.93,57.91 | C13.2 12.62,66.27 v12.39,66.24
  Bottom 0.318: v19.15,67.11 19.2,67.36 19.25,67.31 | v26.01,67.06 26.01,66.85 26.11,66.95
  Bottom 0.406: v76.25,64.57 75.84,64.16 75.95,64.06
  Bottom 0.508: v20.95,24.77 20.95,25.15 | v4.45,24.64 4.45,24.89 | v37.47,24.38 37.21,24.26 | v57.78,24.64 57.78,24.89 | v77.85,24.64 77.85,24.89
  Bottom 0.635: v72.14,41.91 72.14,42.42 | v71.75,32.26 72.01,32.26 72.14,32.13 | v75.82,65.79 75.82,65.41 75.95,65.28 | 76.83,77.09 v77.34,77.6 77.47,77.72 | v54.1,81.53 53.59,81.41 53.72,81.28
  Bottom 0.762: v64.26,18.03 64.26,17.78 | v45.21,18.41 45.21,18.29 | v27.05,18.54 27.43,18.03 | v10.54,18.54 10.54,18.03
  Bottom 1.016: v84.33,17.78 84.33,16.76 | v58.93,57.91 59.05,57.78 59.31,57.78 | v12.39,66.24 12.6,66.6 12.39,66.8
  other vias: 77.42,65.13
  pour Route15: 1.27,57.15 1.27,30.48 45.97,30.35 45.97,57.02
  pour Bottom: 1.27,6.35 1.27,93.98 97.79,93.98 97.79,6.35
  pour Top: 76.25,65.94 76.3,66.19 75.79,66.29 72.24,62.84 72.14,59.44 78.23,59.44 78.23,66.04
GNDBB  (via drill 0.6, 1)
  Top 0.318: IC8.P$19 27.94,82.35 28.04,82.45
  Top 0.508: 28.04,82.45 v28.6,83.01
  Top 1.524: C14.CATHODE v3.25,82.3 | D1.A 3.23,76.68 v3.2,76.66
  Route15 0.508: v28.6,83.01 28.7,83.01 28.75,83.06
  Route15 1.524: v3.25,82.3 3.3,81.48 | v3.2,76.66 3.2,76.76 3.25,76.81
  pour Route15: 85.34,85.85 85.34,93.98 2.54,93.98 2.54,62.99 11.68,62.99 11.58,80.52 31.7,80.52 31.8,85.8
ISOGND  (via drill 0.6)
  Top 0.635: IC7.5 v84.33,66.17 | C7.1 v82.68,76.71
  Route15 0.635: v84.33,66.17 84.71,66.17 | v82.68,76.71 82.68,76.83 82.8,76.96
  other vias: 82.65,65.07 84.07,64.77
  pour Route15: 80.64,53.34 80.75,82.35 97.69,82.42 97.84,53.42 84.07,53.59
  pour Top: 81.79,66.34 85.34,66.34 85.34,59.33 81.79,59.33
LED_BLUE
  Top 1.016: U$1.35/A16 53.85,54.1 53.85,60.2 50.8,63.25 U$8.P$3
LED_GREEN  (via drill 0.6)
  Top 0.635: U$1.2 9.14,40.77 19.18,50.8 61.98,50.8 v62.87,51.69 | v62.87,56.52 57.91,56.52 U$8.P$1
  Bottom 0.635: v62.87,51.69 v62.87,56.52
LED_RED
  Top 1.016: U$1.36/A17 52.32,56.75 U$8.P$4
N$1
  Top 0.635: IC3.8 42.55,16.64 45.97,16.51 46.35,16.51 SERIAL4.4
N$2  (via drill 0.6)
  Top 0.635: IC3.7 41.27,16.64 v42.93,14.73
  Bottom 0.635: v42.93,14.73 42.93,13.97 41.15,12.19 41.15,10.67 43.69,8.13 48.01,8.13 48.77,8.89 48.77,10.03 SERIAL4.3
N$3
  Top 0.635: IC3.6 40.01,16.38 43.18,12.7 SERIAL4.2
N$4
  Top 0.635: IC3.5 38.73,16.13 43.94,10.16 SERIAL4.1
N$5
  Top 0.635: IC3.2 41.27,35.94 26.92,35.94 U$1.9
N$6  (via drill 0.6)
  Top 0.635: IC3.3 40.01,34.67 v30.99,34.67
  Bottom 0.635: U$1.10 29.46,34.67 v30.99,34.67
N$7
  Top 0.635: IC1.8 8.26,16.38 9.4,15.24 12.7,15.24 13.72,14.22 13.72,12.83 SERIAL5.4
N$8  (via drill 0.6)
  Top 0.635: IC1.7 6.99,15.88 v6.86,15.75
  Bottom 0.635: v6.86,15.75 3.81,15.75 3.05,14.99 3.05,12.19 7.11,7.87 11.94,7.87 12.45,8.64 12.45,10.03 SERIAL5.3
N$9
  Top 0.635: IC1.6 5.71,14.86 8.89,13.21 10.79,13.21 SERIAL5.2
N$10
  Top 0.635: IC1.5 4.45,13.84 8.13,10.16 SERIAL5.1
N$11  (via drill 0.6)
  Top 0.635: IC1.2 6.99,25.27 v6.86,25.4
  Bottom 0.635: v6.86,25.4 5.59,25.4 4.06,27.18 U$1.0
N$12
  Top 0.635: IC1.3 5.71,36.96 U$1.1
N$13
  Top 0.635: IC6.3 85.22,39.88 87,38.1 90.17,38.1 92.2,40.13 92.2,42.42 91.19,43.43 U$4.GND
N$14
  Top 0.635: U$4.S 87.5,40.89 83.69,44.7 R3.2
N$15
  Top 0.635: U$3.S 86.23,22.86 86.23,30.73 83.31,33.66 R2.2
N$16
  Top 0.635: U$3.GND 89,30.89 81.28,38.61 IC6.2
N$17
  Top 0.635: IC2.8 24.77,16.74 25.45,16.76 28.63,16.76 SERIAL3.4
N$18  (via drill 0.6)
  Top 0.635: IC2.7 23.5,16.69 v25.15,14.73
  Bottom 0.635: v25.15,14.73 22.81,12.39 22.81,10.97 26.16,7.87 29.97,7.87 30.73,8.89 30.73,10.03 SERIAL3.3
N$19
  Top 0.635: IC2.6 22.23,16.38 24.64,13.46 28.32,13.46 SERIAL3.2
N$20
  Top 0.635: IC12.7 56.26,80.26 64.39,86.23 64.39,89.7 PORT2.1
N$21
  Top 0.635: IC2.5 20.95,15.98 25.73,10.16 SERIAL3.1
N$22
  Top 0.635: IC2.2 23.5,35.31 21.84,36.96 U$1.7
N$23
  Top 1.016: SERIAL5.5 14.73,10.03 14.73,9.02 16.13,7.62 18.41,7.62 20.95,10.16 20.95,13.84 18.8,16 C8.2 17.91,16.26 L1.2 17.66,19.17
N$24
  Top 0.635: IC12.9 46.48,81.53 46.1,81.92 46.1,89.36 PORT3.1
N$25
  Top 1.016: U$8.P$2 56.28,63.75 58.93,63.75 R1.2
N$26
  Top 1.016: IC9.0V 16,23.62 15.36,22.98 C8.1 15.36,14.48 16.13,13.72 SERIAL5.6
N$27
  Top 0.635: IC7.7 86.36,68.71 86.36,75.06 88.27,76.96 U$5.S
N$28  (via drill 0.6)
  Top 0.635: IC2.3 22.23,23.95 22.1,24.18 22.1,33.86 v21.97,33.98
  Bottom 0.635: v21.97,33.98 21.97,35.28 U$1.8
N$29
  Top 1.524: U$1.VIN 1.52,56.26 F1.1
N$30
  Top 0.635: IC7.6 86.51,67.44 86.51,60.2 87.63,58.93 U$2.S
N$31
  Top 0.635: 28.57,90.42 28.5,90.42 | 28.5,90.42 PORT4.1 | IC12.11 40.59,78.99 40.59,85.5 33.43,85.5 28.5,90.42
N$32
  Top 0.635: IC5.8 81.66,16 SERIAL1.4
N$33  (via drill 0.6)
  Top 0.635: IC5.7 v80.39,15.49
  Bottom 0.635: v80.39,15.49 77.34,15.49 76.71,14.86 76.71,10.54 79.63,7.62 83.06,7.62 83.69,8.26 SERIAL1.3
N$34
  Top 0.635: IC5.6 79.12,14.22 SERIAL1.2
N$35
  Top 0.635: IC5.5 77.85,13.46 SERIAL1.1
N$36
  Top 0.635: IC4.8 61.59,16.38 62.36,15.62 65.15,15.62 66.93,13.84 SERIAL2.4
N$37  (via drill 0.6)
  Top 0.635: IC4.7 60.33,16.13 62.1,14.35 v62.61,14.35
  Bottom 0.635: v62.61,14.35 62.61,14.22 59.94,11.56 59.94,9.53 61.72,7.75 65.79,7.75 66.17,8.38 SERIAL2.3
N$38
  Top 0.635: IC4.6 59.05,15.75 62.23,12.7 SERIAL2.2
N$39
  Top 1.016: IC9.+VOUT 18.54,22.61 L1.1
N$40
  Top 0.635: IC4.5 57.78,15.11 62.87,10.03 63.25,10.03 SERIAL2.1
N$41
  Top 1.016: IC9.-VIN 13.46,33.66 J1.2
N$42
  Top 0.635: U$1.34/A15 57.4,53.85 58.67,55.12 67.31,55.12 67.31,27.81 78.87,27.81 80.39,26.42 IC5.2
N$43
  Top 1.016: IC10.0V 32.51,16.76 C10.1 33.02,13.59 SERIAL3.6 33.64,12.96
N$44
  Top 0.635: C10.2 36.2,16.26 | 35.43,17.01 35.44,17.01 35.69,16.76
  Top 1.016: L2.2 35.43,17.01 | 35.69,16.76 36.2,16.26 38.86,13.59 38.86,9.78 36.83,7.75 33.4,7.75 32.64,8.51 SERIAL3.5
N$45
  Top 1.016: L2.1 35.05,22.1 IC10.+VOUT
N$46
  Top 1.016: IC10.-VIN 29.97,33.15 26.54,33.15 J2.2
N$47
  Top 1.016: IC11.0V 50.8,16.38 C9.1 51.05,13.97 SERIAL4.6 51.55,12.84
N$48
  Top 0.635: IC5.3 79.12,25.27 77.98,26.42 65.15,26.42 65.15,53.09 U$1.33/A14
N$49
  Top 1.016: 53.35,19.3 L3.2 53.72,16.26 C9.2 53.98,16.13 56.52,13.59 56.52,9.91 54.61,8 51.18,8 50.42,8.76 SERIAL4.5
N$50
  Top 1.016: IC11.+VOUT 53.34,22.1 L3.1
N$51
  Top 1.016: IC11.-VIN 48.26,33.66 J3.2
N$52
  Top 0.635: IC4.2 60.33,35.94 57.4,35.94 U$1.31/A12
N$53  (via drill 0.6)
  Top 0.635: IC4.3 v59.05,34.54
  Bottom 0.635: v59.05,34.54 59.05,36.96 U$1.32/A13
N$54
  Top 0.635: IC6.1 79.76,37.34 79.88,37.21 79.88,33.78 R2.1
N$55
  Top 0.635: R3.1 79.63,41.46 IC6.4
N$56
  Top 0.635: IC12.5 72.26,77.72 83.95,87.63 83.95,88.77 PORT1.1
N$64
  Top 0.635: IC7.8 84.07,69.98 84.33,70.23 84.33,71.37 83.69,72.01 82.8,72.01 C7.2
PORT1IN
  Top 0.635: U$1.39/A20 44.7,64.14 48.64,67.94 56.52,67.94 60.2,71.75 60.33,76.45 IC12.4
PORT1LED
  Top 0.635: PORT1.3 79.76,91.06 80.72,92.18 84.84,92.18 85.34,91.57 85.34,87.12 72.52,75.95 68.58,75.95 58.04,65.66 50.42,65.66 48.77,64.01 48.77,54.1 U$1.37/A18
PORT2IN  (via drill 0.6)
  Top 0.635: IC12.6 v61.98,78.99 | v61.98,76.2 61.85,71.37 57.28,66.8 49.4,66.8 46.61,64.01 46.61,53.72 U$1.38/A19
  Bottom 0.635: v61.98,78.99 v61.98,76.2
PORT2LED  (via drill 0.6)
  Top 0.635: U$1.14/A0 32,56.39 34.29,58.67 37.34,58.67 48.13,69.47 56.01,69.47 58.8,72.26 v58.8,73.41 | v58.8,80.14 59.56,80.14 66.17,85.22 66.17,91.57 65.3,92.18 61.67,92.18 61.09,91.69 61.09,90.47 PORT2.3
  Bottom 0.635: v58.8,73.41 v58.8,80.14
PORT3IN  (via drill 0.6)
  Top 0.635: IC12.10 v42.37,80.31 | v42.37,77.47 42.42,69.47 34.92,62.61 28.35,62.61 21.84,56.08 U$1.18/A4
  Bottom 0.635: v42.37,80.31 v42.37,77.47
PORT3LED  (via drill 0.6)
  Top 0.635: U$1.16/A2 26.92,56.34 31.75,61.16 35.97,61.16 43.84,69.04 43.84,77.06 v44.5,77.72
  Route2 0.635: v44.5,77.72 44.5,84.43 47.4,84.43 47.4,92.35 43.69,92.35 42.47,91.44 PORT3.3
PORT4IN
  Top 0.635: IC12.12 46.23,77.72 45.57,76.96 45.57,68.58 36.7,59.94 33.15,59.94 29.46,56.52 U$1.15/A1
PORT4LED  (via drill 0.6)
  Top 0.635: U$1.17/A3 24.38,56.77 v28.57,60.96
  Route2 0.635: PORT4.3 23.88,91.57 24.97,92.35 28.02,92.35 34.67,85.85 34.72,71.91 29.87,66.29 v29.72,66.14
  Bottom 0.635: v28.57,60.96 28.65,60.96 29.72,61.72 v29.72,66.14
VBB
  Top 1.524: J8.PWR 10.73,71.72 10.16,72.29 10.16,76.67 D1.C 9.64,77.22 C14.ANODE 10.57,82.3 17.1,75.1 IC8.VBB
VCC  (via drill 0.6, 0.8)  (1 unrouted)
  Top 0.318: IC8.P$2 17.54,66.84 C13.1
  Top 0.635: IC1.1 8.26,24.26 8.38,24.38 10.03,24.38 10.54,23.88 C1.1 | IC2.1 24.77,24 25.15,24.38 26.92,24.38 26.92,23.88 C2.1 | IC3.1 42.55,24 42.93,24.38 45.09,24.38 45.21,24.26 C3.1 | IC4.1 61.59,24 61.98,24.38 63.75,24.38 64.26,23.88 C4.1 v65.78,22.99 v65.79,22.99 | IC5.1 81.66,24 82.04,24.38 83.82,24.38 84.33,23.88 C5.1 84.2,22.86 v82.68,22.99 | 55.12,71.24 C12.2 54.86,72.01 54.36,72.01 53.72,72.64 IC12.1
  Top 0.762: C1.1 11.94,22.99 v12.06,22.99 | IC6.8 72.39,37.34 C11.1 70.23,36.71 69.47,35.94 v69.47,29.21
  Top 1.016: C2.1 v28.57,22.99 | C3.1 v46.73,22.86 v46.74,22.86
  Top 1.27: U$1.3.3V3 37.08,39.75 38.35,40.77 60.83,40.77 62.23,39.24 v62.23,28.32 | v47.12,70.87 55.25,70.87 C12.2 | U$1.3.3V 6.6,53.75 v17.02,63.96 17.02,66.12 C13.1
  Route2 0.635: v65.79,22.99 66.29,22.99 | v82.68,22.99 84.07,22.86
  Route2 0.762: v12.06,22.99 11.94,23.5 | v69.47,29.21 69.72,29.21
  Route2 1.016: v28.57,22.99 29.08,22.99 | v46.74,22.86 47.37,22.86
  Route2 1.27: v62.23,28.32 63.25,28.32 62.48,27.56 | v17.02,63.96 31.93,63.91 v38.68,70.36
  Bottom 1.27: v38.68,70.36 46.61,70.36 v47.12,70.87
  pour Route2: 1.4,29.46 1.27,20.32 91.57,20.45 91.57,29.34
VLV1IN
  Top 0.318: IC8.P$6 20.14,67.69 20.47,67.31 | IC8.P$7 20.79,67.68 20.47,67.46
  Top 0.635: U$1.23/A9 9.09,53.09 20.47,64.21 20.47,67.31 20.47,67.46
VLV1OUT
  Top 0.318: IC8.P$33 18.84,82.4 18.64,82.65 18.09,82.5 18.19,82.35 18.14,82.35 | 18.14,82.35 17.98,82.5 17.73,82.5 17.58,82.35 17.42,82.45 | 17.42,82.45 17.22,82.5 17.07,82.5 16.89,82.32 IC8.P$36 | IC8.P$35 17.54,82.28 17.42,82.45 | IC8.P$34 18.19,82.29 18.14,82.35
  Top 0.635: 16.82,82.65 18.64,82.65
  Top 0.762: 16.82,82.65 12.95,82.6 9.96,85.6 9.96,89.97 13.97,94.13 65.94,94.13 69.6,90.32 69.6,87.38 71.68,85.29 74.42,85.29 75.95,86.82 PORT1.6
VLV2IN
  Top 0.318: IC8.P$8 21.44,67.72 21.79,67.51 22.09,67.76 IC8.P$9
  Top 0.635: U$1.22/A8 11.68,53.65 21.79,63.7 21.79,67.51
VLV2OUT
  Top 0.318: IC8.P$29 21.44,82.45 21.39,82.5 20.88,82.5 | 20.88,82.5 20.78,82.4 | 20.78,82.4 20.68,82.4 20.57,82.5 | 20.57,82.5 20.47,82.5 | 20.47,82.5 20.27,82.5 | 20.27,82.5 20.17,82.4 | 20.17,82.4 20.02,82.4 19.91,82.5 19.51,82.5 19.51,81.72 IC8.P$32 | IC8.P$31 20.14,82.37 20.17,82.4 | IC8.P$30 20.79,82.39 20.78,82.4 | 20.88,82.5 20.57,82.5 | 20.27,82.5 19.56,82.5 | 20.42,82.75 20.42,82.55 20.47,82.5
  Top 0.762: 20.42,82.75 20.42,83.21 18.8,84.07 13.72,84.07 11.58,86.21 11.58,89.41 14.63,92.61 48.77,92.61 50.85,90.37 50.85,87.38 53.03,85.19 56.19,85.19 57.45,86.46 57.45,87.75
  Top 1.016: 57.45,87.75 PORT2.6
VLV3IN
  Top 0.318: IC8.P$12 24.04,67.76 24.33,67.56 24.69,67.77 IC8.P$13
  Top 0.635: U$1.20/A6 16.76,54.86 24.38,62.48 24.33,67.56
VLV3OUT  (via drill 0.6)
  Top 0.318: IC8.P$24 24.69,82.4 24.74,82.45 25.3,82.45 25.35,82.4 25.35,81.66 IC8.P$23 25.34,82.39 25.4,82.45 25.65,82.45 | 25.65,82.45 25.96,82.45 26.01,82.4 26.01,81.67 IC8.P$22 25.99,82.43 26.01,82.45 26.57,82.45 26.62,82.4 26.62,81.67 IC8.P$21 26.64,82.43 26.62,82.45 | 25.7,82.65 25.7,82.5 25.65,82.45
  Top 0.762: 25.7,82.65 25.7,82.96 27.79,84.53 29.11,84.53 31.29,82.35 v37.03,82.35
  Bottom 0.762: v37.03,82.35 37.03,85.65 38.71,86.92 38.71,87.87
  Bottom 1.016: 38.71,87.87 PORT3.6
VLV4IN
  Top 0.318: IC8.P$10 22.74,67.84 23.06,67.56 23.39,67.84 IC8.P$11
  Top 0.635: U$1.21/A7 14.33,54.3 23.06,63.04 23.06,67.56
VLV4OUT
  Top 0.318: IC8.P$25 24.04,82.44 23.93,82.55 23.16,82.55 | 23.52,82.55 23.42,82.45 | 23.42,82.45 23.27,82.45 23.16,82.55 | 23.16,82.55 23.01,82.55 | 23.01,82.55 22.91,82.55 | 22.91,82.55 22.76,82.4 22.71,82.4 | 22.71,82.4 22.55,82.55 | 22.55,82.55 22.25,82.55 22.1,82.45 22.1,81.66 IC8.P$28 | IC8.P$27 22.74,82.36 22.71,82.4 | IC8.P$26 23.39,82.42 23.42,82.45 | 22.91,82.55 22.55,82.55 | 23.01,82.8 23.01,82.55
  Top 0.762: 23.01,82.8 22.96,84.23 20.07,86.31 PORT4.6

### Text on the board
tPlace: Sanworks.io | 10uf | + | + | IC8 | . | Pos. Ctr | 12-24VDC | Bpod FSM v2.0 | Teensy 3.6 | POWER | POWER | POWER